# EAGLE design Adaptive Cable Equalizer (EAGLE 9.6.2)
CHECKED_BY: Maxim Yudayev; MADE_BY: Maxim Yudayev; RELEASE_DATE: May 2nd, 2021; REV: v1.0; STATUS: Released

## Sheet 1 of 2: Cover
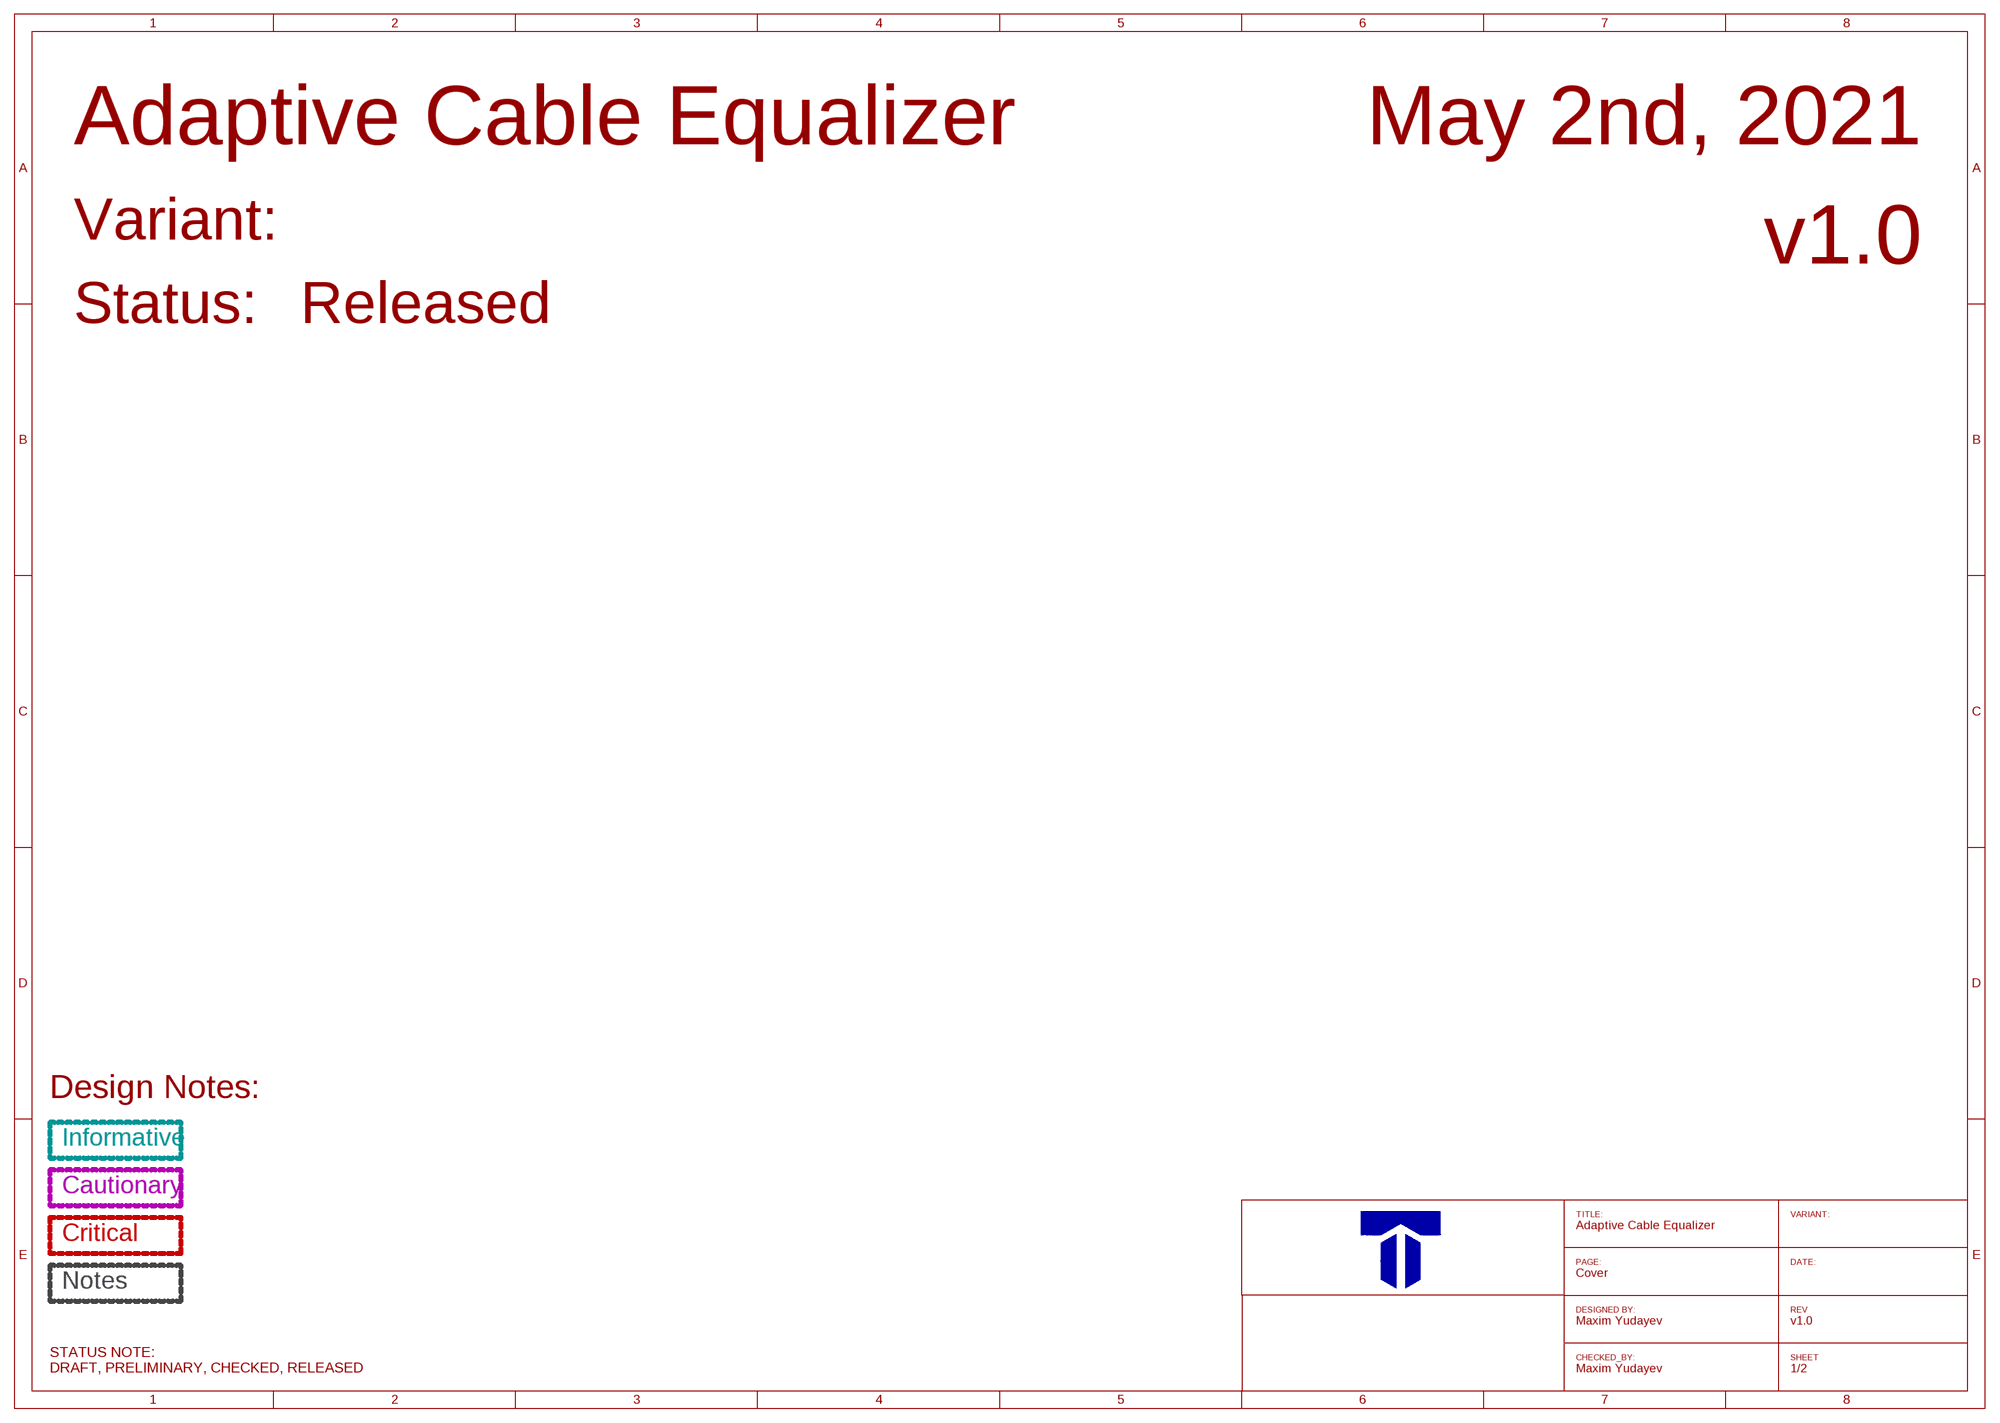
[diagram p0: schematic, sheet 1]

## Sheet 2 of 2: Adaptive Cable Equalizer
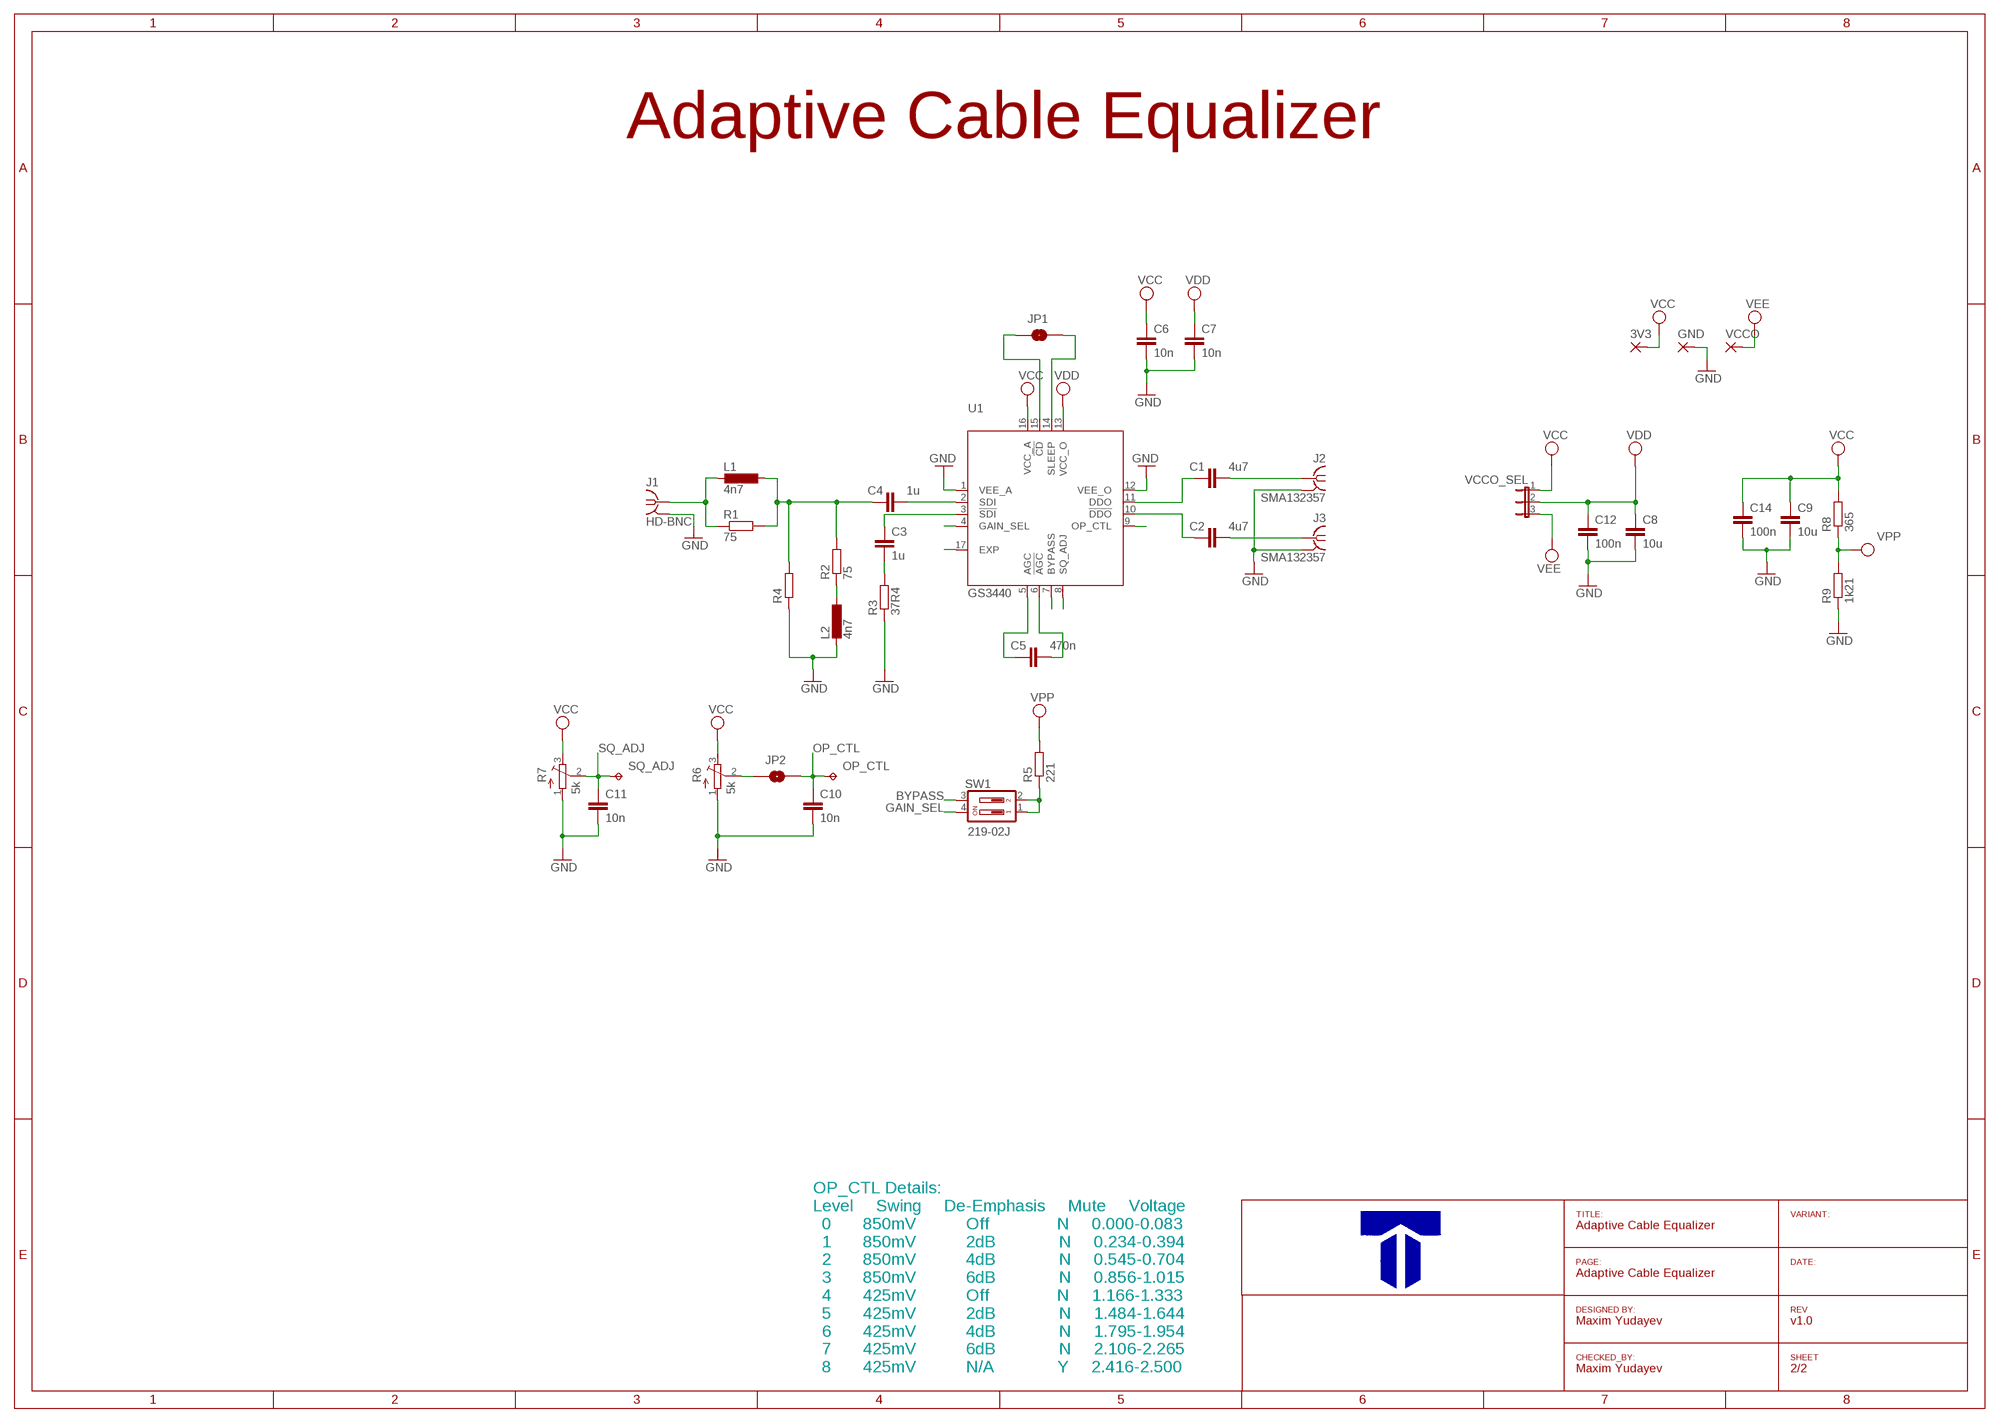
[diagram p1: schematic, sheet 2]

### Parts
3V3  TAB_37800568(MSTIN)  [HOLE_1-3]
C1  4u7  C0402  [0402]
C2  4u7  C0402  [0402]
C3  1u  C0402  [0402]
C4  1u  C0402  [0402]
C5  470n  C0402  [0402]
C6  10n  C0402  [0402]
C7  10n  C0402  [0402]
C8  10u  C-EUC0805K  [C0805K]
C9  10u  C-EUC0805K  [C0805K]
C10  10n  C0402  [0402]
C11  10n  C0402  [0402]
C12  100n  C0402  [0402]
C14  100n  C0402  [0402]
GND  TAB_37800568(MSTIN)  [HOLE_1-3]
J1  HD-BNC  [034_1018_12G]
J2  SMA132357  [SMA]
J3  SMA132357  [SMA]
JP1  SMD-JUMPER  [SMD-JUMPER]
JP2  SMD-JUMPER  [SMD-JUMPER]
L1  4n7  L0402  [0402]
L2  4n7  L0402  [0402]
OP_CTL  TPTP06R  [TP06R]
R1  75  R0402  [0402]
R2  75  R0402  [0402]
R3  37R4  R0402  [0402]
R4  R0402  [0402]
R5  221  R0402  [0402]
R6  5k  TRIM_EU-3223W  [3223W]
R7  5k  TRIM_EU-3223W  [3223W]
R8  365  R0402  [0402]
R9  1k21  R0402  [0402]
SQ_ADJ  TPTP06R  [TP06R]
SW1  219-02J  [CTS-219-02J]
U1  GS3440  [QFN65P400X400X90-17T260N]
VCCO  TAB_37800568(MSTIN)  [HOLE_1-3]
VCCO_SEL  JP2E  [JP2]

### Nets
!CD: JP1.P$1 U1.15(!CD)
BYPASS: SW1.3 U1.7(BYPASS)
GAIN_SEL: SW1.4 U1.4(GAIN_SEL)
GND: C6.2 C7.2 C8.2 C9.2 C10.2 C11.2 C12.2 C14.2 GND.P$1(P) J1.G@1 J1.G@2 J1.G@3 J1.G@4 J2.G@1 J2.G@2 J2.G@3 J2.G@4 J3.G@1 J3.G@2 J3.G@3 J3.G@4 L2.2 R3.1 R4.1 R6.1(A) R7.1(A) R9.1 U1.1(VEE_A) U1.12(VEE_O) U1.17(EXP)
N$1 [50 Ohm]: C2.2 J3.1
N$2 [50 Ohm]: C1.2 J2.1
N$3: C2.1 U1.10(!DDO)
N$4: C1.1 U1.11(DDO)
N$5 [75 Ohm]: J1.P$1 L1.2 R1.1
N$6 [75 Ohm]: C4.1 L1.1 R1.2 R2.2 R4.2
N$7 [75 Ohm]: C3.1 U1.3(!SDI)
N$8 [75 Ohm]: C4.2 U1.2(SDI)
N$9: L2.1 R2.1
N$10: C5.1 U1.5(AGC)
N$11 [75 Ohm]: C3.2 R3.2
N$12: C5.2 U1.6(!AGC)
N$16: JP2.P$1 R6.2(S)
N$17: JP1.P$2 U1.14(SLEEP)
N$19: R5.1 SW1.1 SW1.2
OP_CTL: C10.1 JP2.P$2 OP_CTL.TP U1.9(OP_CTL)
SQ_ADJ: C11.1 R7.2(S) SQ_ADJ.TP U1.8(SQ_ADJ)
VCC: 3V3.P$1(P) C6.1 C9.1 C14.1 R6.3(E) R7.3(E) R8.2 U1.16(VCC_A) VCCO_SEL.1
VDD: C7.1 C8.1 C12.1 U1.13(VCC_O) VCCO_SEL.2
VEE: VCCO.P$1(P) VCCO_SEL.3
VPP: R5.2 R8.1 R9.2

### Notes on the sheet
- OP_CTL Details:
  Level     Swing     De-Emphasis     Mute     Voltage
    0       850mV           Off               N     0.000-0.083
    1       850mV           2dB              N     0.234-0.394
    2       850mV           4dB              N     0.545-0.704
    3       850mV           6dB              N     0.856-1.015
    4       425mV           Off               N     1.166-1.333
    5       425mV           2dB              N     1.484-1.644
    6       425mV           4dB              N     1.795-1.954
    7       425mV           6dB              N     2.106-2.265
    8       425mV           N/A              Y     2.416-2.500

## Library data of the parts
3V3 GND VCCO = Maxim's KU Leuven:TAB_37800568(MSTIN)
C1-C7 C10-C12 C14 = labHDE_rev3:C0402
C8 C9 = Maxim's KU Leuven:C-EU: CAPACITOR, European symbol; SPICEPREFIX: C
J1 = labHDE_rev3:HD-BNC: HD BNC 75 Ohm AMPHENOL RF
J2 J3 = labHDE_rev3:SMA: SMA 50 Ohm End Launch Jack Receptacle - Round Contact AMPHENOL RF
JP1 JP2 = Maxim's KU Leuven:SMD-JUMPER
L1 L2 = labHDE_rev3:L0402
OP_CTL SQ_ADJ = testpad:TP: Test pad
R1-R5 R8 R9 = labHDE_rev3:R0402
R6 R7 = pot:TRIM_EU-: POTENTIOMETER
SW1 = switch-dil:219-02*: Surface Mount DIP Switch Series 219 SMT CTS Electronic Components Sourc: www.ctscorp.com; OC_FARNELL: unknown; OC_NEWARK: unknown
U1 = labHDE_rev3:GS3440: Adaptive Cable Equalizer
VCCO_SEL = jumper:JP2E: JUMPER

## Net classes
1 75 Ohm: width 0.336 mm
2 50 Ohm: width 0.713 mm

## Board
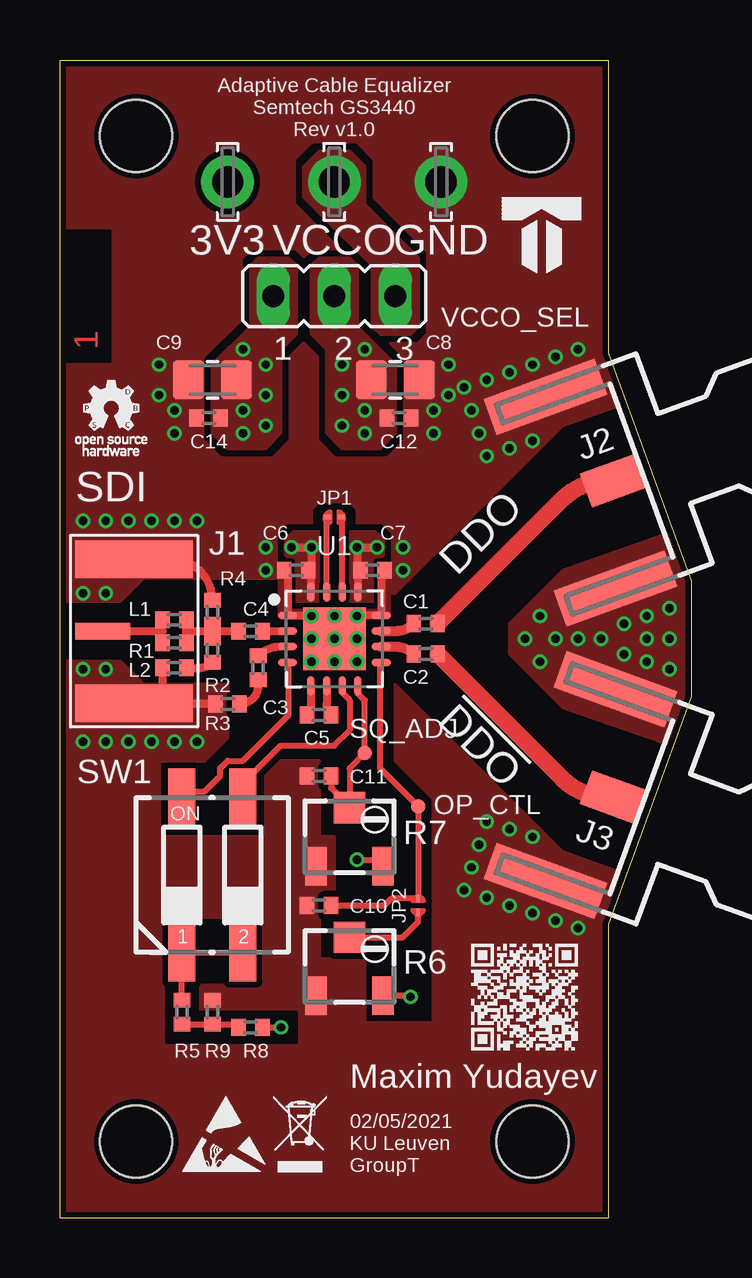
[diagram p2: board, top side]
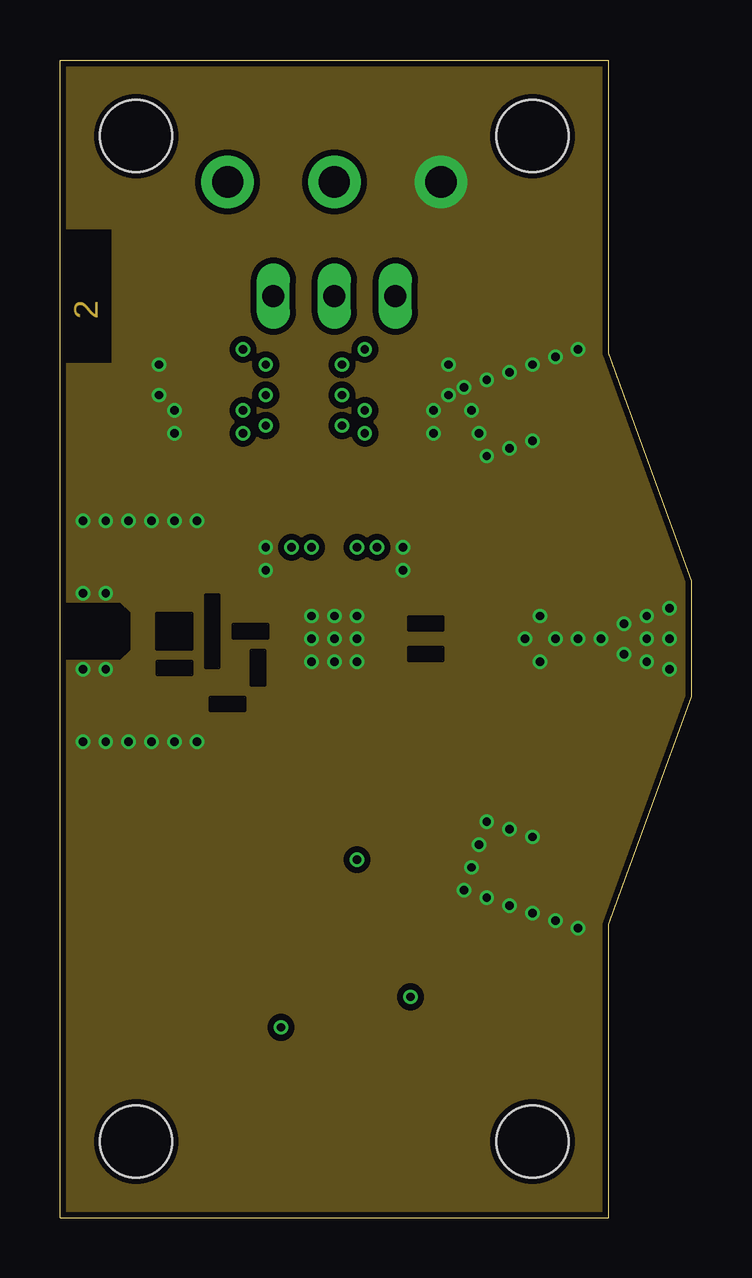
[diagram p3: board, inner layer Route2]
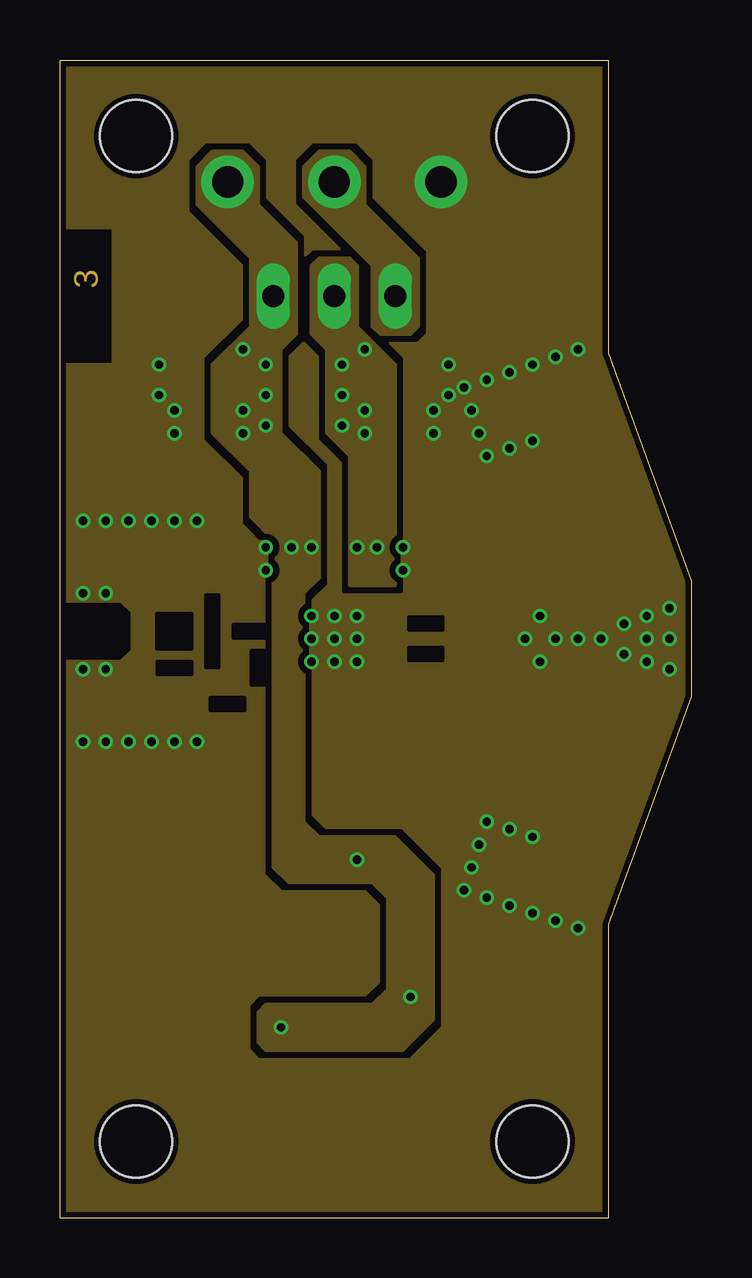
[diagram p4: board, inner layer Route15]
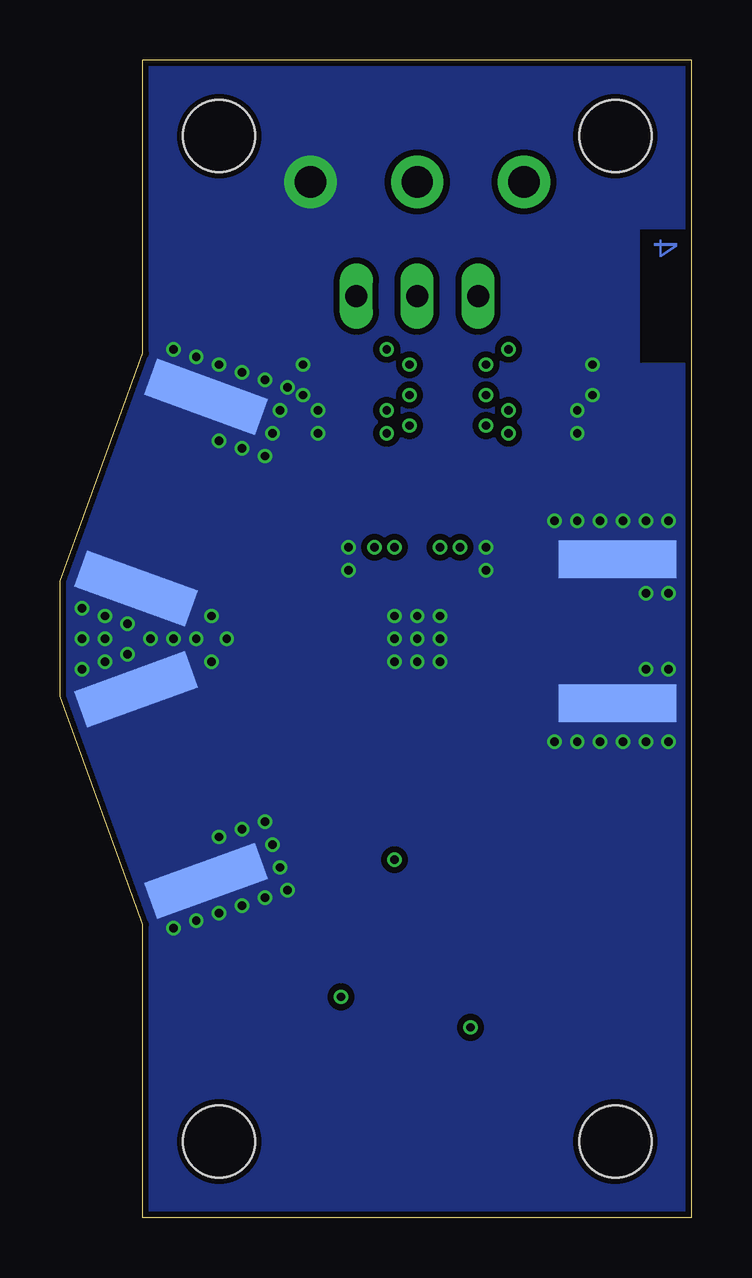
[diagram p5: board, bottom side, seen from below]

Size 26.31 x 48.26 mm. Coordinates in mm from the lower left corner, seen from the top.
Outline: 0,0 22.86,0 22.86,12.23 26.31,21.72 26.31,26.54 22.86,36.03 22.86,48.26 0,48.26 0,0
Copper layers (1+2*15+16): Top 0.018mm / dielectric 0.402mm / Route2 0.035mm / dielectric 0.711mm / Route15 0.035mm / dielectric 0.402mm / Bottom 0.018mm
Design rules "eC_4Layer_PClass6_BaseCopperO18-I35_eCDefault *": minimum track width 0.15mm, minimum drill 0.35mm, track to track 0.15mm, track to pad 0.15mm, pad to pad 0.15mm, via to via 0.15mm, smd to smd 0mil, copper to edge 0.25mm, drill to drill 0.35mm, minimum pad ring 0.175mm, minimum via ring 0.125mm, stop-mask expansion 0mil, vias tented up to drill 0.45mm, thermal gap 0.2mm
Holes 3 mm at 3.17,3.17 19.68,3.17 19.68,45.09 3.17,45.09

### Footprints (pad centres in the part's own frame; a part is rotated, then mirrored left to right if it is on the bottom)
HOLE_1-3 = drill 1.3 pad 2.184: P$1 0,0
0402 = smd 0.6 x 0.7: 1 -0.5,0; 2 0.5,0
C0805K = smd 1.3 x 1.6: 1 -1,0; 2 1,0
034_1018_12G = smd 1.58 x 4.9: G@1 -3,2.45; G@2 3,2.45 | smd 1.58 x 4.9 bottom: G@3 -3,2.45; G@4 3,2.45 | smd 0.7 x 2.3: P$1 0,1.15
SMA = smd 2.35 x 1.5: 1 1.175,0 | smd 4.9 x 1.6: G@1 2.6,4.25; G@2 2.6,-4.25 | smd 4.9 x 1.6 bottom: G@3 2.6,4.25; G@4 2.6,-4.25
SMD-JUMPER = smd 0.305 x 0.152: P$1 -0.286,0; P$2 0.286,0
TP06R = smd 0.6 x 0.6: TP 0,0
3223W = smd 0.9 x 1.6: 1 -1.4,-1.215; 3 1.4,-1.215 | smd 1.3 x 1.3: 2 0,1.215
CTS-219-02J = smd 1.13 x 2.44: 1 -1.27,-3.215; 2 1.27,-3.215; 3 1.27,3.215; 4 -1.27,3.215
QFN65P400X400X90-17T260N = smd 0.811 x 0.32: 1 -1.951,0.975; 2 -1.951,0.325; 3 -1.951,-0.325; 4 -1.951,-0.975; 9 1.951,-0.975; 10 1.951,-0.325; 11 1.951,0.325; 12 1.951,0.975 | smd 0.32 x 0.811: 5 -0.975,-1.951; 6 -0.325,-1.951; 7 0.325,-1.951; 8 0.975,-1.951; 13 0.975,1.951; 14 0.325,1.951; 15 -0.325,1.951; 16 -0.975,1.951 | smd 2.6 x 2.6: 17 0,0
JP2 = drill 0.914 long: 1 -2.54,0; 2 0,0; 3 2.54,0

### Placement (x,y rotation side)
3V3  6.99,43.18 180 top
C1  15.24,24.77 0 top
C2  15.24,23.5 0 top
C3  8.26,22.92 270 top
C4  7.94,24.45 0 top
C5  10.79,20.95 0 top
C6  9.84,26.99 180 top
C7  13.02,26.99 0 top
C8  13.97,34.92 0 top
C9  6.35,34.92 180 top
C10  10.79,13.02 180 top
C11  10.79,18.41 180 top
C12  14.13,33.34 0 top
C14  6.19,33.34 180 top
GND  15.88,43.18 180 top
J1  0.64,24.45 270 top
J2  24.13,31.11 200 top
J3  24.13,17.14 160 top
JP1  11.43,29.21 0 top
JP2  14.92,13.02 90 top
L1  4.76,24.92 180 top
L2  4.76,22.92 180 top
OP_CTL  14.92,17.14 0 top
R1  4.76,23.97 0 top
R2  6.35,23.65 90 top
R3  6.99,21.41 0 top
R4  6.35,25.24 270 top
R5  5.08,8.57 270 top
R6  12.06,10.48 0 top
R7  12.06,15.88 0 top
R8  7.94,7.94 0 top
R9  6.35,8.57 270 top
SQ_ADJ  12.7,19.37 0 top
SW1  6.35,14.29 0 top
U1  11.43,24.13 0 top
VCCO  11.43,43.18 180 top
VCCO_SEL  11.43,38.42 0 top

### Tracks (layer width: path | path; a pad name or v marks a point on that pad's centre or on a via)
!CD
  Top 0.254: U1.15 11.11,29.11
  Top 0.327: 11.11,29.11 arc-45 JP1.P$1
BYPASS
  Top 0.254: U1.7 11.76,21.9 12.06,21.59 12.06,20.32 11.43,19.68 9.21,19.68 7.62,18.1 SW1.3
GAIN_SEL
  Top 0.254: 9.53,23.11 9.53,20.95 7.62,19.05 6.99,19.05 6.67,18.73 6.67,18.41 6.03,17.78 5.36,17.78 SW1.4
  Top 0.327: 9.53,23.11 arc90 U1.4
GND  (via drill 0.35)
  Top 0.327: U1.17 v10.48,25.08 arc45 10.42,25.11 U1.1 9.48,26.85 C6.2 | U1.17 v12.38,25.08 arc-45 12.44,25.11 U1.12 13.38,26.85 C7.2 | v11.43,25.08 U1.17 | U1.17 v10.48,24.13 | U1.17 v10.48,23.18 | U1.17 v11.43,23.18 | U1.17 v12.38,23.18 | U1.17 v12.38,24.13 | 3.12,21.41 arc-90 J1.G@2
  Top 0.336: L2.2 4.26,21.97 3.74,21.45 J1.G@2 | R3.1 3.12,21.41 | R4.1 arc90 4.64,27.45 J1.G@1
  other vias: 11.43,24.13 23.5,24.77 24.45,24.13 24.45,25.08 25.4,25.4 25.4,24.13 25.4,22.86 24.45,23.18 23.5,23.5 22.54,24.13 21.59,24.13 20,23.18 20.64,24.13 19.37,24.13 20,25.08 19.68,15.88 18.73,16.19 17.78,16.51 17.46,15.56 17.14,14.61 16.83,13.65 17.78,13.34 18.73,13.02 19.68,12.7 20.64,12.38 21.59,12.06 19.68,32.38 18.73,32.07 17.78,31.75 17.46,32.7 17.14,33.66 16.83,34.61 17.78,34.92 18.73,35.24 19.68,35.56 20.64,35.88 21.59,36.2 1.91,26.04 0.95,26.04 0.95,22.86 1.91,22.86 0.95,19.84 1.91,19.84 2.86,19.84 3.81,19.84 4.76,19.84 5.71,19.84 0.95,29.05 1.91,29.05 2.86,29.05 3.81,29.05 4.76,29.05 5.71,29.05 16.19,34.29 16.19,35.56 15.56,33.66 15.56,32.7 4.13,35.56 4.13,34.29 4.76,33.66 4.76,32.7 8.57,26.99 8.57,27.94 14.29,27.94 14.29,26.99
  pour Top (isolate 0.254, no thermals): 18.73,23.5 18.73,24.77 20.95,26.99 25.57,28.6 26.31,26.54 26.31,21.72 25.57,19.66 20.95,21.27
  pour Top (isolate 0.254, no thermals): 13.97,22.23 13.97,19.05 15.56,17.46 15.56,8.13 12.7,8.13 12.7,10.79 10.79,10.79 10.79,13.65 11.43,13.65 11.43,15.88 10.79,15.88 10.79,19.05 9.21,19.05 8.57,18.41 8.57,15.88 4.13,15.88 4.13,19.05 6.03,19.05 6.99,20 6.99,22.23 3.49,22.23 2.54,23.18 0,23.18 0,0 22.86,0 22.86,12.23 23.61,14.28 20.95,15.24
  pour Top (isolate 0.254, rank 2, no thermals): 13.02,25.35 12.7,25.35 12.7,25.08 13.72,25.08 13.72,26.04 13.97,26.04 20.95,33.02 23.61,33.98 22.86,36.03 22.86,48.26 0,48.26 0,41.27 2.22,41.27 2.22,35.56 0,35.56 0,25.72 2.54,25.72 3.49,26.67 9.14,26.67 9.14,25.08 10.16,25.08 10.16,25.35 9.84,25.35 9.84,27.3 9.53,27.62 9.53,28.26 9.84,28.57 10.16,28.57 10.48,28.89 10.48,29.53 10.79,29.84 12.06,29.84 12.38,29.53 12.39,28.89 12.7,28.57 13.02,28.57 13.34,28.26 13.34,27.62 13.02,27.3
  pour Bottom (isolate 0.305, no thermals): 18.73,23.5 18.73,24.77 20.95,26.99 25.57,28.6 26.31,26.54 26.31,21.72 25.57,19.66 20.95,21.27
  pour Bottom (isolate 0.305, no thermals): 19.05,17.14 16.67,17.14 15.56,16.03 15.56,12.54 16.67,11.43 22.86,11.43 22.86,12.23 23.61,14.28 20.95,15.24
  pour Bottom (isolate 0.305, no thermals): 0,19.05 6.99,19.05 6.99,22.23 3.49,22.23 2.54,23.18 0,23.18
  pour Bottom (isolate 0.305, no thermals): 0,29.84 6.99,29.84 6.99,26.67 3.49,26.67 2.54,25.72 0,25.72
  pour Route2 (isolate 0.254, rank 2, no thermals): 0,0 22.86,0 22.86,12.23 26.31,21.72 26.31,26.54 22.86,36.03 22.86,48.26 0,48.26 0,41.27 2.22,41.27 2.22,35.56 0,35.56 0,25.72 2.54,25.72 3.01,25.24 3.01,23.65 2.54,23.18 0,23.18
  pour Route15 (isolate 0.254, rank 2, no thermals): 0,0 0,23.18 2.54,23.18 3.01,23.65 3.01,25.24 2.54,25.72 0,25.72 0,35.56 2.22,35.56 2.22,41.27 0,41.27 0,48.26 22.86,48.26 22.86,36.04 26.31,26.54 26.35,26.51 26.31,21.72 22.86,12.23 22.86,0
  pour Bottom (isolate 0.305, no thermals): 19.05,31.11 16.67,31.11 15.56,32.23 15.56,35.72 16.67,36.83 22.86,36.83 22.86,36.03 23.61,33.98 20.95,33.02
  pour Bottom (isolate 0.254, rank 2, no thermals): 0,0 22.86,0 22.86,12.23 26.31,21.72 26.31,26.54 22.86,36.03 22.86,48.26 0,48.26 0,41.27 2.22,41.27 2.22,35.56 0,35.56
N$1
  Top 0.713: C2.2 20.94,18.29 arc45 22.74,17.55 J3.1
N$2
  Top 0.713: C1.2 20.94,29.97 arc-45 22.74,30.71 J2.1
N$3
  Top 0.406: U1.10 13.99,23.8 arc-45 C2.1
N$4
  Top 0.406: U1.11 13.99,24.45 arc45 C1.1
N$5
  Top 0.336: L1.2 R1.1 4.26,24.45 J1.P$1
N$6
  Top 0.336: R1.2 L1.1 5.26,24.45 6.35,24.45 | 6.35,24.45 C4.1 | 6.35,24.45 R2.2 R4.2
N$7
  Top 0.336: U1.3 9.18,23.8 arc45 C3.1
N$8
  Top 0.336: C4.2 U1.2
N$9
  Top 0.327: L2.1 5.79,22.92 arc45 R2.1
N$10
  Top 0.327: U1.5 10.46,21.34 arc-45 C5.1
N$11
  Top 0.336: C3.2 8.26,22.18 arc-90 R3.2
N$12
  Top 0.327: U1.6 11.11,21.41 arc45 C5.2
N$13
  cutout Route2 (no thermals): 4.04,23.7 4.04,25.2 5.49,25.2 5.49,23.7
N$14
  cutout Route2 (no thermals): 4.04,22.65 4.04,23.2 5.48,23.2 5.48,22.65
N$15
  cutout Route2 (no thermals): 7.22,24.17 7.22,24.72 8.66,24.72 8.66,24.17
N$16
  Top 0.254: R6.2 14.29,11.69 14.92,12.33 JP2.P$1
N$17
  Top 0.254: U1.14 11.76,29.11
  Top 0.327: 11.76,29.11 arc45 JP1.P$2
N$18
  cutout Route2 (no thermals): 6.27,21.14 6.27,21.69 7.7,21.69 7.7,21.14
N$19
  Top 0.254: SW1.2 SW1.1 R5.1
N$20
  cutout Route2 (no thermals): 8.53,22.2 7.98,22.2 7.98,23.65 8.53,23.65
N$21
  cutout Route2 (no thermals): 6.62,22.93 6.08,22.93 6.08,25.97 6.62,25.97
N$22
  cutout Top (no thermals): 4.45,12.38 4.45,7.3 9.84,7.3 9.84,8.57 5.71,8.57 5.71,9.84 8.26,9.84 8.26,12.38
N$23
  cutout Route2 (no thermals): 14.52,24.49 14.52,25.04 15.96,25.04 15.96,24.49
N$24
  cutout Route2 (no thermals): 14.52,23.22 14.52,23.77 15.96,23.77 15.96,23.22
N$25
  cutout Route15 (no thermals): 4.04,23.7 4.04,25.2 5.49,25.2 5.49,23.7
N$26
  cutout Route15 (no thermals): 4.04,22.65 4.04,23.2 5.48,23.2 5.48,22.65
N$27
  cutout Route15 (no thermals): 7.22,24.17 7.22,24.72 8.66,24.72 8.66,24.17
N$28
  cutout Route15 (no thermals): 6.27,21.14 6.27,21.69 7.7,21.69 7.7,21.14
N$29
  cutout Route15 (no thermals): 8.53,22.2 7.98,22.2 7.98,23.65 8.53,23.65
N$30
  cutout Route15 (no thermals): 6.62,22.93 6.08,22.93 6.08,25.97 6.62,25.97
N$31
  cutout Route15 (no thermals): 14.52,24.49 14.52,25.04 15.96,25.04 15.96,24.49
N$32
  cutout Route15 (no thermals): 14.52,23.22 14.52,23.77 15.96,23.77 15.96,23.22
OP_CTL
  Top 0.254: U1.9 13.34,23.11 13.34,18.73 OP_CTL.TP JP2.P$2 13.8,13.3 13.52,13.02 C10.1
SQ_ADJ
  Top 0.254: R7.2 12.06,18.73 SQ_ADJ.TP 12.7,21.57 12.4,21.86 U1.8 | C11.1 11.29,17.91 12.06,17.14
  Top 0.327: 12.06,17.14 R7.2
VCC  (via drill 0.35)
  Top 0.254: R8.2 v9.21,7.94 | R6.3 14.55,9.26 v14.61,9.21 | v12.38,14.92 13.2,14.92 R7.3
  Top 0.327: U1.16 10.46,26.88 C6.1 10.48,27.12 v10.48,27.94 v9.65,27.94
  other vias: 8.57,35.56 8.57,34.29 7.62,33.66 7.62,32.7 8.57,33.02 7.62,36.2
  pour Route15 (isolate 0.254, no thermals): 9.84,40.64 8.26,42.23 8.26,43.81 7.62,44.45 6.35,44.45 5.71,43.81 5.71,42.23 7.94,40.01 7.94,37.15 6.35,35.56 6.35,32.7 7.94,31.11 7.94,29.21 8.89,28.26 8.89,14.61 9.53,13.97 13.02,13.97 13.65,13.34 13.65,9.53 13.02,8.89 8.57,8.89 8.26,8.57 8.26,7.3 8.57,6.99 14.29,6.99 15.56,8.26 15.56,14.29 13.97,15.88 10.79,15.88 10.16,16.51 10.16,26.04 10.79,26.67 10.79,31.11 9.21,32.7 9.21,36.2 9.84,36.83
  pour Top (isolate 0.254, no thermals): 9.84,39.69 9.53,40.01 8.26,40.01 7.94,39.69 7.94,37.15 6.35,35.56 6.35,32.7 6.99,32.07 8.57,32.07 9.21,32.7 9.21,36.2 9.84,36.83
  pour Top (no thermals): 9.4,28.26 9.4,27.62 9.72,27.3 9.72,25.72 10.79,25.72 10.79,28.57 9.72,28.57
VDD  (via drill 0.35)
  Top 0.327: U1.13 12.4,26.88 C7.1 12.38,27.12 v12.38,27.94 v13.21,27.94
  other vias: 11.75,35.56 11.75,34.29 12.7,33.66 12.7,32.7 11.75,33.02 12.7,36.2
  pour Route15 (isolate 0.254, no thermals): 10.48,36.83 10.48,39.69 10.79,40.01 12.06,40.01 12.38,39.69 12.38,37.15 13.97,35.56 13.97,26.35 12.06,26.35 12.06,31.75 11.11,32.7 11.11,36.2
  pour Top (isolate 0.254, no thermals): 10.48,39.69 10.79,40.01 12.06,40.01 12.38,39.69 12.38,37.15 13.97,35.56 13.97,32.7 13.34,32.07 11.75,32.07 11.11,32.7 11.11,36.2 10.48,36.83
  pour Top (no thermals): 12.06,28.57 13.14,28.57 13.46,28.26 13.46,27.62 13.14,27.3 13.14,25.72 12.06,25.72
VEE
  pour Route15 (isolate 0.254, no thermals): 10.16,43.81 10.79,44.45 12.06,44.45 12.7,43.81 12.7,42.23 14.92,40.01 14.92,37.15 14.61,36.83 13.34,36.83 13.02,37.15 13.02,39.69 10.16,42.55
  pour Top (isolate 0.254, no thermals): 10.16,43.81 10.79,44.45 12.06,44.45 12.7,43.81 12.7,42.23 14.92,40.01 14.92,37.15 14.61,36.83 13.34,36.83 13.02,37.15 13.02,39.69 10.16,42.55
VPP
  Top 0.254: R5.2 R9.2 7.3,8.07 R8.1

### Text on the board
Top: 1
Route2: 2
Route15: 3
Bottom: 4
tPlace: Adaptive Cable Equalizer / Semtech GS3440 / Rev v1.0 | Maxim Yudayev | 02/05/2021 / KU Leuven / GroupT
tNames: SDI | DDO | !DDO
Document: 4-Layer STD Build 1.6mm (1.621mm before plating, 1.655mm after) | Layer 1 - RF + signal -> 18um (1/2 oz) copper | 402um Isola IS400 2x7268 prepreg -> Epsilon_r 4.35@2GHz | Layer 2 - GND -> 35um (1 oz) copper | 711um Isola IS400 4x7268core -> Epsilon_r 4.48@2GHz | Layer 15 - Power + GND -> 35um (1 oz) copper | 402um Isola IS400 2x7268 prepreg -> Epsilon_r 4.35@2GHz | Layer 16 - GND -> 18um (1/2 oz) copper | XV501T DI soldermask -> Epsilon_r 3.95@1MHz | Surface Microstrip Impedance Control: / / 50 Ohm - 712.75um / 75 Ohm - 335.82um / / Coated Microstrip Impedance Control: (not used) / / 50 Ohm - 581.96um / 75 Ohm - 224um